# Altium project Test_npf.PrjPCB
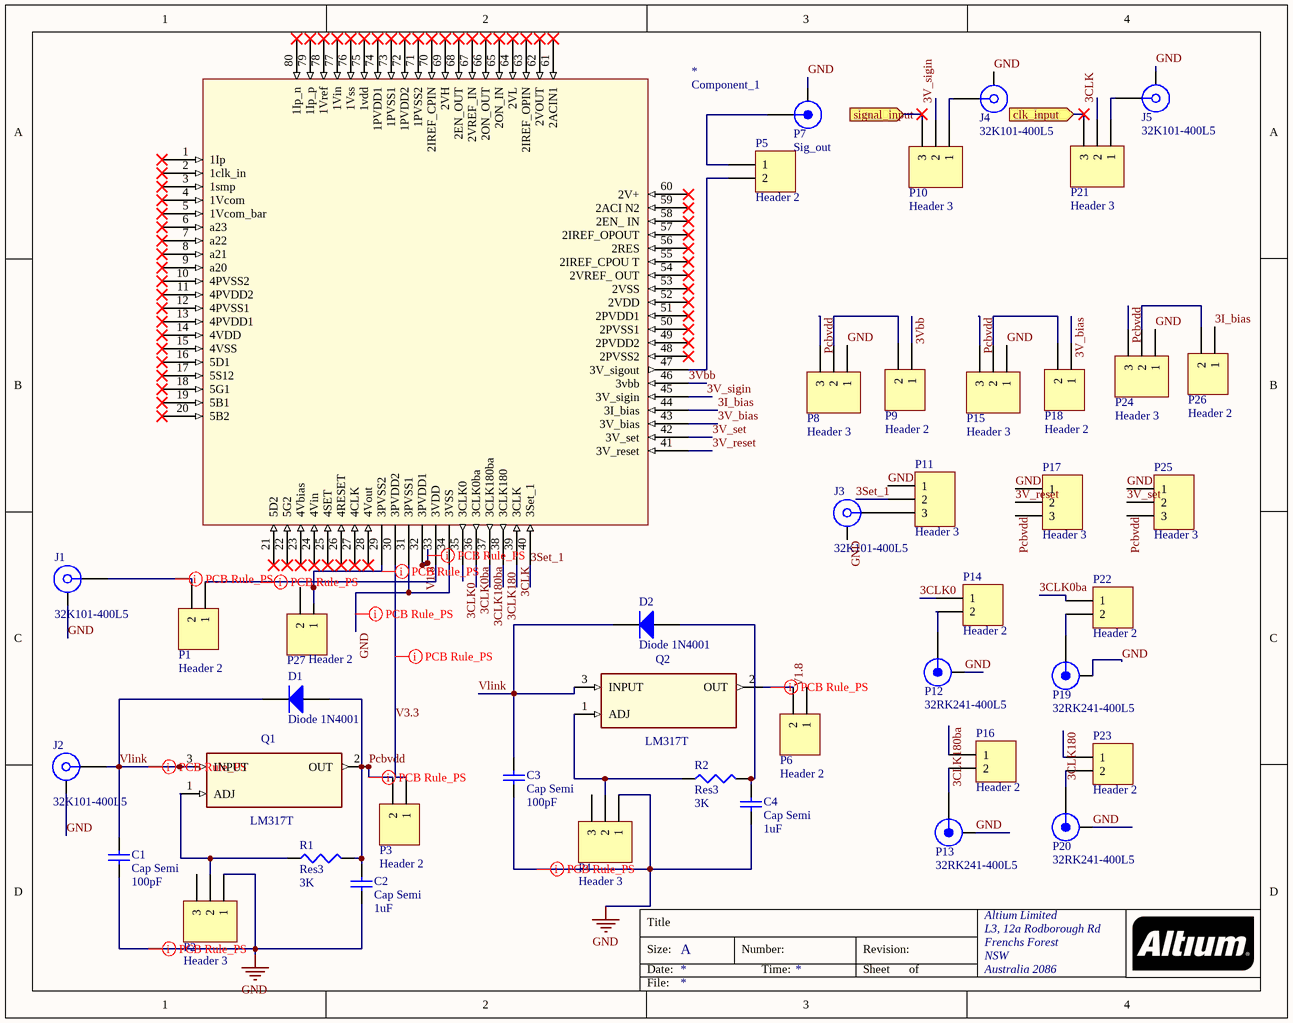
[diagram p0: test_npf.SchDoc]
1 sheet, 43 parts. Net scope: flat (ports and power ports of the same name join across sheets).
Board files: test_npf.PcbDoc, test_npf.PcbDoc, test_npf.PcbDoc

## Sheet test_npf.SchDoc
size A; Organization: Altium Limited; Address1: L3, 12a Rodborough Rd; Address2: Frenchs Forest; Address3: NSW; Address4: Australia 2086

### Parts
*  Component_1  [LCCS50P1200X1200X85-80N]
C1  Cap Semi  value 100pF  [C1206]
C2  Cap Semi  value 1uF  [C1206]
C3  Cap Semi  value 100pF  [C1206]
C4  Cap Semi  value 1uF  [C1206]
D1  Diode 1N4001  [DO-41]
D2  Diode 1N4001  [DO-41]
J1  32K101-400L5  [ROS-32K101-400L5_V]
J2  32K101-400L5  [ROS-32K101-400L5_V]
J3  32K101-400L5  [ROS-32K101-400L5_V]
J4  32K101-400L5  [ROS-32K101-400L5_V]
J5  32K101-400L5  [ROS-32K101-400L5_V]
P1  Header 2  [HDR1X2]
P2  Header 3  [HDR1X3]
P3  Header 2  [HDR1X2]
P4  Header 3  [HDR1X3]
P5  Header 2  [HDR1X2]
P6  Header 2  [HDR1X2]
P7  Sig_out  [ROS-32K101-400L5_V]
P8  Header 3  [HDR1X3]
P9  Header 2  [HDR1X2]
P10  Header 3  [HDR1X3]
P11  Header 3  [HDR1X3]
P12  32RK241-400L5  [ROS-32K101-400L5_V]
P13  32RK241-400L5  [ROS-32K101-400L5_V]
P14  Header 2  [HDR1X2]
P15  Header 3  [HDR1X3]
P16  Header 2  [HDR1X2]
P17  Header 3  [HDR1X3]
P18  Header 2  [HDR1X2]
P19  32RK241-400L5  [ROS-32K101-400L5_V]
P20  32RK241-400L5  [ROS-32K101-400L5_V]
P21  Header 3  [HDR1X3]
P22  Header 2  [HDR1X2]
P23  Header 2  [HDR1X2]
P24  Header 3  [HDR1X3]
P25  Header 3  [HDR1X3]
P26  Header 2  [HDR1X2]
P27  Header 2  [HDR1X2]
Q1  LM317T  [TO254P450X1020X2000-3P]
Q2  LM317T  [TO254P450X1020X2000-3P]
R1  Res3  value 3K  [J1-0603]
R2  Res3  value 3K  [J1-0603]

### Ports
clk_input (in), signal_input (in)

### Nets
GND: *.31(3PVSS1) *.34(3VSS) C1.1 C2.1 C3.1 C4.1 J1.MH J2.MH J3.MH J4.MH J5.MH P2.1 P4.1 P7.MH P8.1 P11.1 P12.MH P13.MH P15.1 P17.1 P19.MH P20.MH P24.1 P25.1
3CLK: *.39(3CLK) P21.2
3CLK0: *.35(3CLK0) P14.1
3CLK0ba: *.36(3CLK0ba) P22.1
3CLK180: *.38(3CLK180) P23.1
3CLK180ba: *.37(3CLK180ba) P16.1
3I_bias: *.44(3I_bias) P26.1
3Set_1: *.40(3Set_1) P11.2
3V_bias: *.43(3V_bias) P18.1
3V_reset: *.41(3V_reset) P17.2
3V_set: *.42(3V_set) P25.2
3V_sigin: *.45(3V_sigin) P10.2
3Vbb: *.46(3vbb) P9.1
Pcbvdd: C2.2 D1.1(A) P3.2 P8.3 P15.3 P17.3 P24.3 P25.3 Q1.2(OUT) R1.2
V1.8: *.32(3PVDD1) P6.1
V3.3: *.30(3PVDD2) P3.1
Vlink: C1.2 C3.2 D1.2(K) D2.2(K) J2.1 Q1.3(INPUT) Q2.3(INPUT)
Net*_29: *.29(3PVSS2) P27.1
Net*_33: *.33(3VDD) P1.1
Net*_47: *.47(3V_sigout) P5.2
NetC4_2: C4.2 D2.1(A) R2.2
NetJ1_1: J1.1 P1.2
NetJ3_1: J3.1 P11.3
NetJ4_1: J4.1 P10.1
NetJ5_1: J5.1 P21.1
NetP2_2: P2.2 Q1.1(ADJ) R1.1
NetP4_2: P4.2 Q2.1(ADJ) R2.1
NetP5_1: P5.1 P7.1
NetP6_2: P6.2 Q2.2(OUT)
NetP8_2: P8.2 P9.2
NetP10_3: P10.3 ; port signal_input
NetP12_1: P12.1 P14.2
NetP13_1: P13.1 P16.2
NetP15_2: P15.2 P18.2
NetP19_1: P19.1 P22.2
NetP20_1: P20.1 P23.2
NetP21_3: P21.3 ; port clk_input
NetP24_2: P24.2 P26.2

Not connected (* = marked no-connect by the designer): * 1(1Ip)* 2(1clk_in)* 3(1smp)* 4(1Vcom)* 5(1Vcom_bar)* 6(a23)* 7(a22)* 8(a21)* 9(a20)* 10(4PVSS2)* 11(4PVDD2)* 12(4PVSS1)* 13(4PVDD1)* 14(4VDD)* 15(4VSS)* 16(5D1)* 17(5S12)* 18(5G1)* 19(5B1)* 20(5B2)* 21(5D2)* 22(5G2)* 23(4Vbias)* 24(4Vin)* 25(4SET)* 26(4RESET)* 27(4CLK)* 28(4Vout)* 48(2PVSS2)* 49(2PVDD2)* 50(2PVSS1)* 51(2PVDD1)* 52(2VDD)* 53(2VSS)* 54(2VREF__OUT)* 55(2IREF_CPOU_T)* 56(2RES)* 57(2IREF_OPOUT)* 58(2EN__IN)* 59(2ACI_N2)* 60(2V+)* 61(2ACIN1)* 62(2VOUT)* 63(2IREF_OPIN)* 64(2VL)* 65(2ON_IN)* 66(2ON_OUT)* 67(2VREF_IN)* 68(2EN_OUT)* 69(2VH)* 70(2IREF_CPIN)* 71(1PVSS2)* 72(1PVDD2)* 73(1PVSS1)* 74(1PVDD1)* 75(1vdd)* 76(1Vss)* 77(1Vin)* 78(1Vref)* 79(1Ip_p)* 80(1Ip_n)*; P2 3; P4 3; P27 2

### Layout directives
rule Width Constraint [Pref Width = 10mil    Min Width = 8mil    Max Width = 20mil]: GND, Net*_29, Net*_33, NetP6_2, Pcbvdd, V1.8, V3.3, Vlink
rule Width Constraint [Pref Width = 15mil    Min Width = 8mil    Max Width = 20mil]: NetJ1_1
rule Width Constraint [Pref Width = 15mil    Min Width = 14mil    Max Width = 20mil]: GND

### Notes on the sheet
- Title
- Size:
- Date:
- A
- Number:
- Time:
- Revision:
- Sheet
- of
- File:

### Library data of the parts
C1-C4 = Cap Semi: Capacitor (Semiconductor SIM Model); Published: 8-Jun-2000; LatestRevisionDate: 29-May-2009; LatestRevisionNote: IPC-7351 Footprint Added.; PackageReference: C1206; Publisher: Altium Limited; PackageDescription: Chip Capacitor
D1 D2 = Diode 1N4001: 1 Amp General Purpose Rectifier; Published: 8-Jun-2000; LatestRevisionDate: 17-Jul-2002; LatestRevisionNote: Re-released for DXP Platform.; DatasheetVersion: 1998; PackageVersion: Aug-1999; PackageReference: DO-41; Publisher: Altium Limited; PackageDescription: Diode, Axial; Body 5.2 x 2.7 mm (LxDia. max), Lead Dia. 0.86 mm (max); Code_JEDEC: DO-204-AL; ComponentLink1Description: Manufacturer Link; ComponentLink1URL: http://www.fairchildsemi.com/; ComponentLink2Description: Datasheet; ComponentLink2URL: http://www.fairchildsemi.com/ds/1N%2F1N4001.pdf
J1-J5 = 32K101-400L5: SMA Straight Jack, Up to 18 GHz, -55 to 155 degC; Design Note: Footprint in library is a generic example - only application specific footprint delivers High Performance; DatasheetVersion: a00; PackageVersion: a00; PackageReference: 32K101-400L5; PackageDescription: SMA Straight Jack, 6.35 x 6.35 x 9.5 mm; Mounting Technology: Through Hole; PartNumber: 32K101-400L5; ComponentLink1Description: Manufacturer URL; ComponentLink1URL: http://www.rosenberger.de; ComponentLink2Description: Datasheet; ComponentLink2URL: http://rosenberger.de/ok/images/documents/db/32K101-400L5.pdf; ComponentLink3Description: Package Specification; ComponentLink3URL: http://rosenberger.de/ok/images/documents/db/32K101-400L5.pdf; ComponentLink4Description: Series Overview / Design Note; ComponentLink4URL: http://rosenberger.de/ok/images/documents/spez/32.pdf; ComponentLink5Description: Webshop / RFQ; ComponentLink5URL: http://www.rosenberger.com/en/contact/sales/
P1 P3 P5 P6 P9 P14 P16 P18 P22 P23 P26 P27 = Header 2: Header, 2-Pin; LatestRevisionDate: 17-Jul-2002; LatestRevisionNote: Re-released for DXP Platform.; Publisher: Altium Limited
P2 P4 P8 P10 P11 P15 P17 P21 P24 P25 = Header 3: Header, 3-Pin; LatestRevisionDate: 17-Jul-2002; LatestRevisionNote: Re-released for DXP Platform.; Publisher: Altium Limited
P7 P12 P13 P19 P20 = 32RK241-400L5: Reverse-SMA Straight Jack, Up to 12.4 GHz, -65 to 165 degC; Design Note: Footprint in library is a generic example - only application specific footprint delivers High Performance; DatasheetVersion: f00; PackageVersion: f00; PackageReference: 32RK241-400L5; PackageDescription: Reverse-SMA Straight Jack, 15.215 x 6.35 x 9.7 mm; Mounting Technology: Through Hole; PartNumber: 32RK241-400L5; ComponentLink1Description: Manufacturer URL; ComponentLink1URL: http://www.rosenberger.de; ComponentLink2Description: Datasheet; ComponentLink2URL: http://rosenberger.de/ok/images/documents/db/32RK241-400L5.pdf; ComponentLink3Description: Package Specification; ComponentLink3URL: http://rosenberger.de/ok/images/documents/db/32RK241-400L5.pdf; ComponentLink4Description: Series Overview / Design Note; ComponentLink4URL: http://rosenberger.de/ok/images/documents/spez/32r.pdf; ComponentLink5Description: Webshop / RFQ; ComponentLink5URL: http://www.rosenberger.com/en/contact/sales/
Q1 Q2 = LM317T: LM317 Series 40 Vin 1.5 A Adjustable Positive Voltage Regulator - TO-220-3; MF: Texas Instruments; Price: None; Package: TO-220 Texas Instruments; SnapEDA_Link: https://www.snapeda.com/parts/LM317T/Texas%20Instruments/view-part/?ref=snap; Availability: Unavailable; MP: LM317T; Value: *
R1 R2 = Res3: Resistor; Published: 8-Jun-2000; LatestRevisionDate: 29-May-2009; LatestRevisionNote: IPC-7351 Footprint Added.; PackageReference: J1-0603; Publisher: Altium Limited; PackageDescription: Chip Resistor